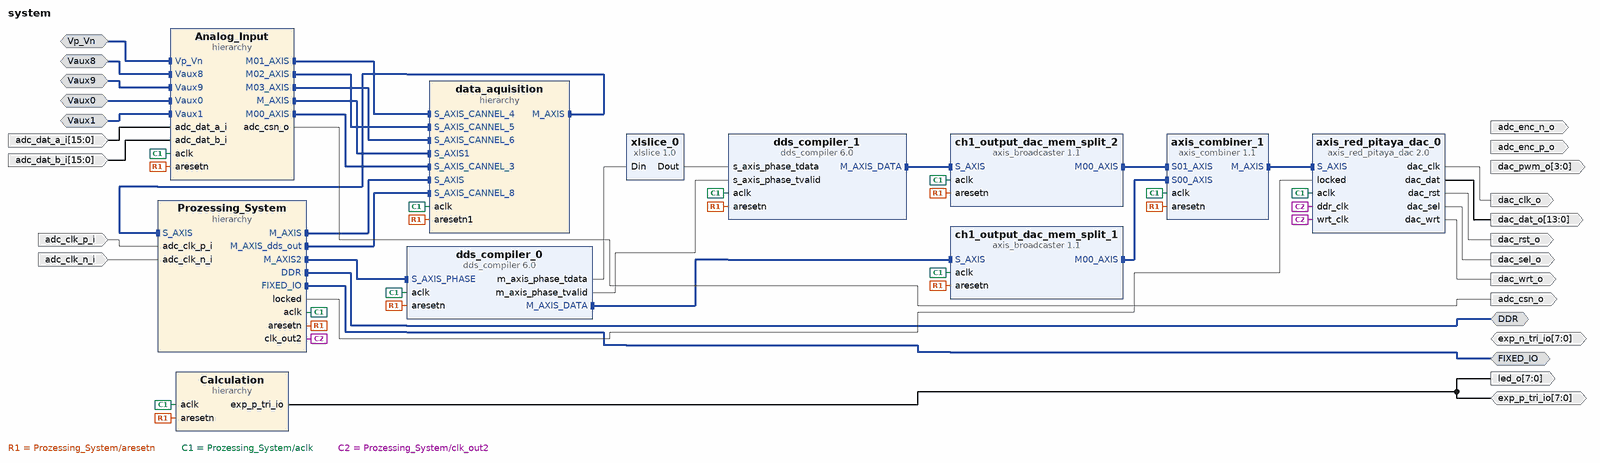
[diagram p0: block diagram of the top level]
# Vivado block design system, xc7z010clg400-1, Vivado 2020.2
create_bd_design system

create_bd_intf_port -mode Master -vlnv xilinx.com:interface:ddrx_rtl:1.0 DDR
create_bd_intf_port -mode Master -vlnv xilinx.com:display_processing_system7:fixedio_rtl:1.0 FIXED_IO
create_bd_intf_port -mode Slave -vlnv xilinx.com:interface:diff_analog_io_rtl:1.0 Vp_Vn
create_bd_intf_port -mode Slave -vlnv xilinx.com:interface:diff_analog_io_rtl:1.0 Vaux0
create_bd_intf_port -mode Slave -vlnv xilinx.com:interface:diff_analog_io_rtl:1.0 Vaux1
create_bd_intf_port -mode Slave -vlnv xilinx.com:interface:diff_analog_io_rtl:1.0 Vaux8
create_bd_intf_port -mode Slave -vlnv xilinx.com:interface:diff_analog_io_rtl:1.0 Vaux9
create_bd_port -dir I -from 15 -to 0 adc_dat_a_i
create_bd_port -dir I -from 15 -to 0 adc_dat_b_i
create_bd_port -dir I adc_clk_p_i
create_bd_port -dir I adc_clk_n_i
create_bd_port -dir O adc_enc_p_o
create_bd_port -dir O adc_enc_n_o
create_bd_port -dir O adc_csn_o
create_bd_port -dir O -from 13 -to 0 dac_dat_o
create_bd_port -dir O dac_clk_o
create_bd_port -dir O dac_rst_o
create_bd_port -dir O dac_sel_o
create_bd_port -dir O dac_wrt_o
create_bd_port -dir O -from 3 -to 0 dac_pwm_o
create_bd_port -dir IO -from 7 -to 0 exp_p_tri_io
create_bd_port -dir IO -from 7 -to 0 exp_n_tri_io
create_bd_port -dir O -from 7 -to 0 led_o

create_bd_cell -type hier Prozessing_System
create_bd_cell -type hier data_aquisition
create_bd_cell -type hier Calculation
create_bd_cell -type ip -vlnv xilinx.com:user:axis_red_pitaya_dac:2.0 axis_red_pitaya_dac_0
create_bd_cell -type hier Analog_Input
create_bd_cell -type ip -vlnv xilinx.com:ip:axis_combiner:1.1 axis_combiner_1
set_property -dict {CONFIG.TDATA_NUM_BYTES 2} [get_bd_cells axis_combiner_1]
create_bd_cell -type ip -vlnv xilinx.com:ip:dds_compiler:6.0 dds_compiler_0
set_property -dict [list \
  CONFIG.DATA_Has_TLAST Not_Required \
  CONFIG.DDS_Clock_Rate 125 \
  CONFIG.Frequency_Resolution 0.4 \
  CONFIG.Has_ARESETn true \
  CONFIG.Latency 7 \
  CONFIG.Noise_Shaping None \
  CONFIG.Output_Frequency1 0 \
  CONFIG.Output_Width 14 \
  CONFIG.PINC1 0 \
  CONFIG.Parameter_Entry Hardware_Parameters \
  CONFIG.Phase_Increment Streaming \
  CONFIG.Phase_Width 30 \
  CONFIG.Phase_offset None \
  CONFIG.S_PHASE_Has_TUSER Not_Required \
] [get_bd_cells dds_compiler_0]
create_bd_cell -type ip -vlnv xilinx.com:ip:dds_compiler:6.0 dds_compiler_1
set_property -dict [list \
  CONFIG.DATA_Has_TLAST Not_Required \
  CONFIG.DDS_Clock_Rate 100 \
  CONFIG.Has_ARESETn true \
  CONFIG.Has_Phase_Out false \
  CONFIG.Latency 6 \
  CONFIG.M_DATA_Has_TUSER Not_Required \
  CONFIG.Noise_Shaping None \
  CONFIG.Optimization_Goal Speed \
  CONFIG.Output_Frequency1 0 \
  CONFIG.Output_Width 14 \
  CONFIG.PINC1 0 \
  CONFIG.Parameter_Entry Hardware_Parameters \
  CONFIG.PartsPresent SIN_COS_LUT_only \
  CONFIG.Phase_Width 16 \
  CONFIG.S_PHASE_Has_TUSER Not_Required \
] [get_bd_cells dds_compiler_1]
create_bd_cell -type ip -vlnv xilinx.com:ip:axis_broadcaster:1.1 ch1_output_dac_mem_split_1
set_property -dict [list \
  CONFIG.M00_TDATA_REMAP {tdata[15:0]} \
  CONFIG.M01_TDATA_REMAP {tdata[31:16]} \
  CONFIG.M02_TDATA_REMAP {tdata[31:16]} \
  CONFIG.M03_TDATA_REMAP {tdata[31:16]} \
  CONFIG.M_TDATA_NUM_BYTES 2 \
  CONFIG.NUM_MI 2 \
  CONFIG.S_TDATA_NUM_BYTES 4 \
] [get_bd_cells ch1_output_dac_mem_split_1]
create_bd_cell -type ip -vlnv xilinx.com:ip:axis_broadcaster:1.1 ch1_output_dac_mem_split_2
set_property -dict [list \
  CONFIG.M00_TDATA_REMAP {tdata[15:0]} \
  CONFIG.M01_TDATA_REMAP {tdata[31:16]} \
  CONFIG.M02_TDATA_REMAP {tdata[31:16]} \
  CONFIG.M03_TDATA_REMAP {tdata[31:16]} \
  CONFIG.M_TDATA_NUM_BYTES 2 \
  CONFIG.NUM_MI 2 \
  CONFIG.S_TDATA_NUM_BYTES 4 \
] [get_bd_cells ch1_output_dac_mem_split_2]
create_bd_cell -type ip -vlnv xilinx.com:ip:xlslice:1.0 xlslice_0
set_property -dict {CONFIG.DIN_FROM 28 CONFIG.DIN_TO 13 CONFIG.DOUT_WIDTH 16} [get_bd_cells xlslice_0]

# ---- hierarchy /Prozessing_System ----
current_bd_instance /Prozessing_System
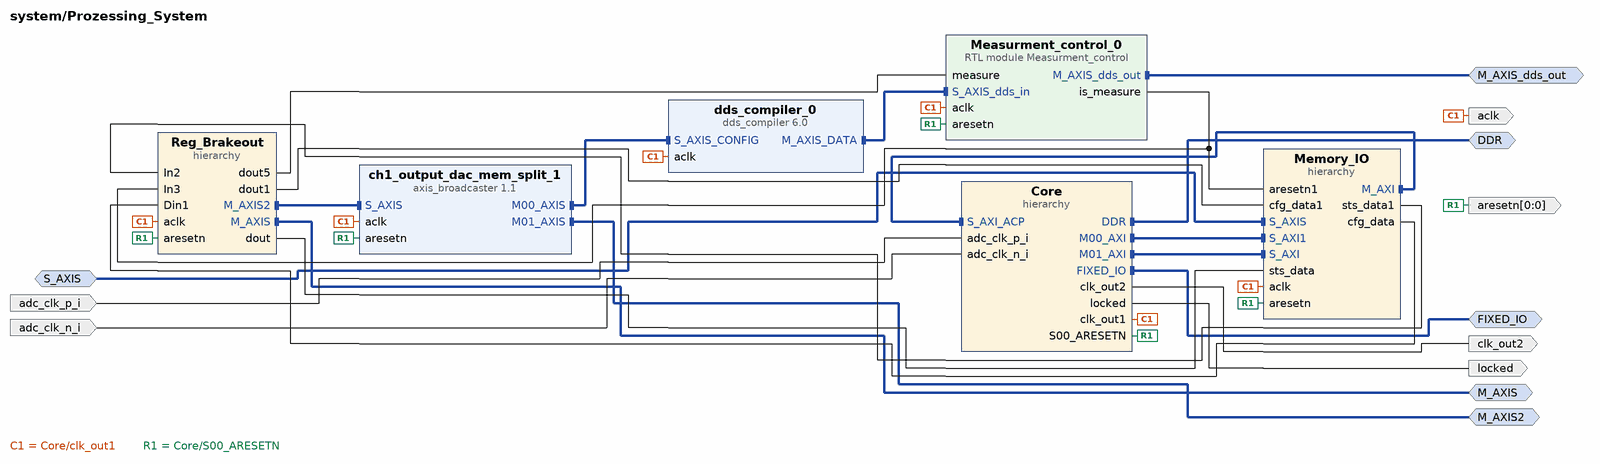
[diagram p1: block diagram inside /Prozessing_System]
create_bd_intf_pin -mode Master -vlnv xilinx.com:interface:ddrx_rtl:1.0 DDR
create_bd_intf_pin -mode Master -vlnv xilinx.com:display_processing_system7:fixedio_rtl:1.0 FIXED_IO
create_bd_intf_pin -mode Slave -vlnv xilinx.com:interface:axis_rtl:1.0 S_AXIS
create_bd_intf_pin -mode Master -vlnv xilinx.com:interface:axis_rtl:1.0 M_AXIS
create_bd_intf_pin -mode Master -vlnv xilinx.com:interface:axis_rtl:1.0 M_AXIS_dds_out
create_bd_intf_pin -mode Master -vlnv xilinx.com:interface:axis_rtl:1.0 M_AXIS2
create_bd_pin -dir O -type clk aclk
create_bd_pin -dir O locked
create_bd_pin -dir O -from 0 -to 0 -type rst aresetn
create_bd_pin -dir I adc_clk_p_i
create_bd_pin -dir I adc_clk_n_i
create_bd_pin -dir O -type clk clk_out2

create_bd_cell -type hier Core
create_bd_cell -type hier Memory_IO
create_bd_cell -type hier Reg_Brakeout
create_bd_cell -type ip -vlnv xilinx.com:ip:dds_compiler:6.0 dds_compiler_0
set_property -dict [list \
  CONFIG.DATA_Has_TLAST Not_Required \
  CONFIG.DDS_Clock_Rate 125 \
  CONFIG.Frequency_Resolution 0.4 \
  CONFIG.Has_Phase_Out false \
  CONFIG.Latency 7 \
  CONFIG.M_DATA_Has_TUSER Not_Required \
  CONFIG.Noise_Shaping None \
  CONFIG.Output_Frequency1 0 \
  CONFIG.Output_Width 16 \
  CONFIG.PINC1 101010 \
  CONFIG.Parameter_Entry Hardware_Parameters \
  CONFIG.Phase_Increment Programmable \
  CONFIG.Phase_Width 30 \
  CONFIG.Resync false \
  CONFIG.S_PHASE_Has_TUSER Not_Required \
] [get_bd_cells dds_compiler_0]
create_bd_cell -type module -reference Measurment_control Measurment_control_0
create_bd_cell -type ip -vlnv xilinx.com:ip:axis_broadcaster:1.1 ch1_output_dac_mem_split_1
set_property -dict [list \
  CONFIG.M00_TDATA_REMAP {tdata[31:0]} \
  CONFIG.M01_TDATA_REMAP {tdata[31:0]} \
  CONFIG.M02_TDATA_REMAP {tdata[31:16]} \
  CONFIG.M03_TDATA_REMAP {tdata[31:16]} \
  CONFIG.M_TDATA_NUM_BYTES 4 \
  CONFIG.NUM_MI 2 \
  CONFIG.S_TDATA_NUM_BYTES 4 \
] [get_bd_cells ch1_output_dac_mem_split_1]

# ---- hierarchy /Prozessing_System/Core ----
current_bd_instance /Prozessing_System/Core
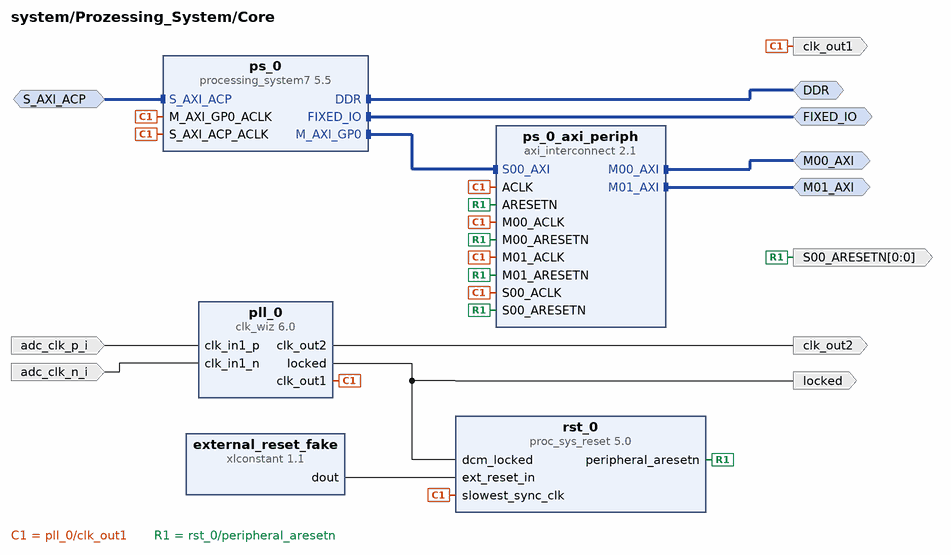
[diagram p2: block diagram inside /Prozessing_System/Core]
create_bd_intf_pin -mode Master -vlnv xilinx.com:interface:ddrx_rtl:1.0 DDR
create_bd_intf_pin -mode Master -vlnv xilinx.com:display_processing_system7:fixedio_rtl:1.0 FIXED_IO
create_bd_intf_pin -mode Slave -vlnv xilinx.com:interface:aximm_rtl:1.0 S_AXI_ACP
create_bd_intf_pin -mode Master -vlnv xilinx.com:interface:aximm_rtl:1.0 M00_AXI
create_bd_intf_pin -mode Master -vlnv xilinx.com:interface:aximm_rtl:1.0 M01_AXI
create_bd_pin -dir O -type clk clk_out1
create_bd_pin -dir O locked
create_bd_pin -dir O -from 0 -to 0 -type rst S00_ARESETN
create_bd_pin -dir I adc_clk_p_i
create_bd_pin -dir I adc_clk_n_i
create_bd_pin -dir O -type clk clk_out2

create_bd_cell -type ip -vlnv xilinx.com:ip:proc_sys_reset:5.0 rst_0
create_bd_cell -type ip -vlnv xilinx.com:ip:clk_wiz:6.0 pll_0
set_property -dict [list \
  CONFIG.CLKOUT1_REQUESTED_OUT_FREQ 125.0 \
  CONFIG.CLKOUT1_USED true \
  CONFIG.CLKOUT2_REQUESTED_OUT_FREQ 250.0 \
  CONFIG.CLKOUT2_REQUESTED_PHASE 157.5 \
  CONFIG.CLKOUT2_USED true \
  CONFIG.CLKOUT3_REQUESTED_OUT_FREQ 250.0 \
  CONFIG.CLKOUT3_REQUESTED_PHASE 202.5 \
  CONFIG.CLKOUT3_USED false \
  CONFIG.CLKOUT4_JITTER 119.348 \
  CONFIG.CLKOUT4_PHASE_ERROR 96.948 \
  CONFIG.CLKOUT4_REQUESTED_OUT_FREQ 125 \
  CONFIG.CLKOUT4_USED false \
  CONFIG.CLKOUT5_JITTER 119.348 \
  CONFIG.CLKOUT5_PHASE_ERROR 96.948 \
  CONFIG.CLKOUT5_REQUESTED_OUT_FREQ 125 \
  CONFIG.CLKOUT5_USED false \
  CONFIG.CLKOUT6_JITTER 119.348 \
  CONFIG.CLKOUT6_PHASE_ERROR 96.948 \
  CONFIG.CLKOUT6_REQUESTED_OUT_FREQ 125 \
  CONFIG.CLKOUT6_USED false \
  CONFIG.MMCM_CLKOUT2_DIVIDE 1 \
  CONFIG.MMCM_CLKOUT3_DIVIDE 1 \
  CONFIG.MMCM_CLKOUT4_DIVIDE 1 \
  CONFIG.MMCM_CLKOUT5_DIVIDE 1 \
  CONFIG.NUM_OUT_CLKS 2 \
  CONFIG.PRIMITIVE PLL \
  CONFIG.PRIM_IN_FREQ 125.0 \
  CONFIG.PRIM_SOURCE Differential_clock_capable_pin \
  CONFIG.USE_RESET false \
] [get_bd_cells pll_0]
create_bd_cell -type ip -vlnv xilinx.com:ip:processing_system7:5.5 ps_0
set_property -dict [list \
  CONFIG.PCW_APU_PERIPHERAL_FREQMHZ 666.666666 \
  CONFIG.PCW_ENET0_ENET0_IO {MIO 16 .. 27} \
  CONFIG.PCW_ENET0_GRP_MDIO_ENABLE 1 \
  CONFIG.PCW_ENET0_GRP_MDIO_IO {MIO 52 .. 53} \
  CONFIG.PCW_ENET0_PERIPHERAL_ENABLE 1 \
  CONFIG.PCW_ENET0_RESET_ENABLE 0 \
  CONFIG.PCW_ENET_RESET_ENABLE 1 \
  CONFIG.PCW_ENET_RESET_SELECT {Share reset pin} \
  CONFIG.PCW_FPGA0_PERIPHERAL_FREQMHZ 50 \
  CONFIG.PCW_FPGA1_PERIPHERAL_FREQMHZ 50 \
  CONFIG.PCW_GPIO_EMIO_GPIO_ENABLE 1 \
  CONFIG.PCW_GPIO_EMIO_GPIO_IO 64 \
  CONFIG.PCW_GPIO_MIO_GPIO_ENABLE 1 \
  CONFIG.PCW_GPIO_MIO_GPIO_IO MIO \
  CONFIG.PCW_GPIO_PERIPHERAL_ENABLE 1 \
  CONFIG.PCW_I2C0_GRP_INT_ENABLE 0 \
  CONFIG.PCW_I2C0_I2C0_IO {MIO 50 .. 51} \
  CONFIG.PCW_I2C0_PERIPHERAL_ENABLE 1 \
  CONFIG.PCW_I2C_PERIPHERAL_FREQMHZ 111.111115 \
  CONFIG.PCW_I2C_RESET_ENABLE 1 \
  CONFIG.PCW_I2C_RESET_SELECT {Share reset pin} \
  CONFIG.PCW_IMPORT_BOARD_PRESET cfg/red_pitaya.xml \
  CONFIG.PCW_PRESET_BANK1_VOLTAGE {LVCMOS 2.5V} \
  CONFIG.PCW_QSPI_PERIPHERAL_ENABLE 0 \
  CONFIG.PCW_SD0_GRP_CD_ENABLE 1 \
  CONFIG.PCW_SD0_GRP_CD_IO {MIO 46} \
  CONFIG.PCW_SD0_GRP_WP_ENABLE 1 \
  CONFIG.PCW_SD0_GRP_WP_IO {MIO 47} \
  CONFIG.PCW_SD0_PERIPHERAL_ENABLE 1 \
  CONFIG.PCW_SD0_SD0_IO {MIO 40 .. 45} \
  CONFIG.PCW_SDIO_PERIPHERAL_FREQMHZ 100 \
  CONFIG.PCW_SPI0_PERIPHERAL_ENABLE 1 \
  CONFIG.PCW_SPI0_SPI0_IO EMIO \
  CONFIG.PCW_SPI1_PERIPHERAL_ENABLE 1 \
  CONFIG.PCW_SPI1_SPI1_IO {MIO 10 .. 15} \
  CONFIG.PCW_UART0_PERIPHERAL_ENABLE 1 \
  CONFIG.PCW_UART0_UART0_IO {MIO 14 .. 15} \
  CONFIG.PCW_UART1_PERIPHERAL_ENABLE 1 \
  CONFIG.PCW_UART1_UART1_IO {MIO 8 .. 9} \
  CONFIG.PCW_UART_PERIPHERAL_FREQMHZ 100 \
  CONFIG.PCW_UIPARAM_DDR_BUS_WIDTH {16 Bit} \
  CONFIG.PCW_UIPARAM_DDR_FREQ_MHZ 533.333333 \
  CONFIG.PCW_UIPARAM_DDR_PARTNO {MT41J256M16 RE-125} \
  CONFIG.PCW_USB0_PERIPHERAL_ENABLE 1 \
  CONFIG.PCW_USB0_RESET_ENABLE 1 \
  CONFIG.PCW_USB0_RESET_IO {MIO 48} \
  CONFIG.PCW_USB0_USB0_IO {MIO 28 .. 39} \
  CONFIG.PCW_USB_RESET_ENABLE 1 \
  CONFIG.PCW_USB_RESET_SELECT {Share reset pin} \
  CONFIG.PCW_USE_DEFAULT_ACP_USER_VAL 1 \
  CONFIG.PCW_USE_S_AXI_ACP 1 \
] [get_bd_cells ps_0]
# 429 more settings of ps_0 are not shown: defaults, MIO pin electricals, DDR timing, and values the tool derives
create_bd_cell -type ip -vlnv xilinx.com:ip:axi_interconnect:2.1 ps_0_axi_periph
set_property -dict {CONFIG.NUM_MI 2} [get_bd_cells ps_0_axi_periph]
create_bd_cell -type ip -vlnv xilinx.com:ip:xlconstant:1.1 external_reset_fake

# ---- hierarchy /Prozessing_System/Memory_IO ----
current_bd_instance /Prozessing_System/Memory_IO
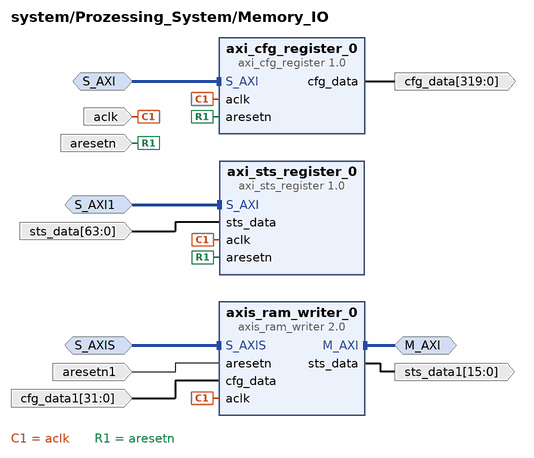
[diagram p3: block diagram inside /Prozessing_System/Memory_IO]
create_bd_intf_pin -mode Slave -vlnv xilinx.com:interface:aximm_rtl:1.0 S_AXI
create_bd_intf_pin -mode Slave -vlnv xilinx.com:interface:aximm_rtl:1.0 S_AXI1
create_bd_intf_pin -mode Slave -vlnv xilinx.com:interface:axis_rtl:1.0 S_AXIS
create_bd_intf_pin -mode Master -vlnv xilinx.com:interface:aximm_rtl:1.0 M_AXI
create_bd_pin -dir I -type clk aclk
create_bd_pin -dir I -type rst aresetn
create_bd_pin -dir I -type rst aresetn1
create_bd_pin -dir I -from 31 -to 0 cfg_data1
create_bd_pin -dir O -from 15 -to 0 sts_data1
create_bd_pin -dir O -from 319 -to 0 cfg_data
create_bd_pin -dir I -from 63 -to 0 sts_data

create_bd_cell -type ip -vlnv xilinx.com:user:axi_sts_register:1.0 axi_sts_register_0
set_property -dict {CONFIG.AXI_ADDR_WIDTH 32 CONFIG.STS_DATA_WIDTH 64} [get_bd_cells axi_sts_register_0]
create_bd_cell -type ip -vlnv xilinx.com:user:axi_cfg_register:1.0 axi_cfg_register_0
set_property -dict {CONFIG.AXI_ADDR_WIDTH 32 CONFIG.CFG_DATA_WIDTH 320} [get_bd_cells axi_cfg_register_0]
create_bd_cell -type ip -vlnv xilinx.com:user:axis_ram_writer:2.0 axis_ram_writer_0
set_property -dict {CONFIG.ADDR_WIDTH 16 CONFIG.AXIS_TDATA_WIDTH 128 CONFIG.AXI_ID_WIDTH 3} [get_bd_cells axis_ram_writer_0]

# ---- hierarchy /Prozessing_System/Reg_Brakeout ----
current_bd_instance /Prozessing_System/Reg_Brakeout
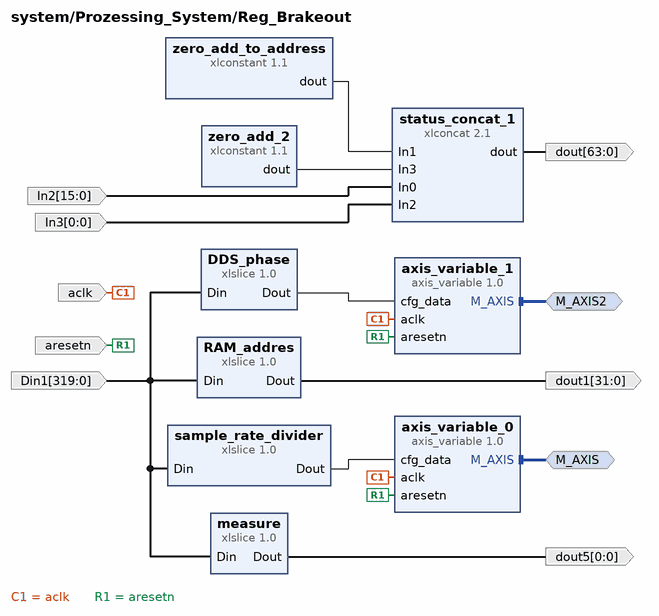
[diagram p4: block diagram inside /Prozessing_System/Reg_Brakeout]
create_bd_intf_pin -mode Master -vlnv xilinx.com:interface:axis_rtl:1.0 M_AXIS
create_bd_intf_pin -mode Master -vlnv xilinx.com:interface:axis_rtl:1.0 M_AXIS2
create_bd_pin -dir I -type clk aclk
create_bd_pin -dir I -type rst aresetn
create_bd_pin -dir O -from 31 -to 0 dout1
create_bd_pin -dir I -from 15 -to 0 In2
create_bd_pin -dir O -from 0 -to 0 dout5
create_bd_pin -dir I -from 319 -to 0 Din1
create_bd_pin -dir I -from 0 -to 0 In3
create_bd_pin -dir O -from 63 -to 0 dout

create_bd_cell -type ip -vlnv xilinx.com:ip:xlconcat:2.1 status_concat_1
set_property -dict [list \
  CONFIG.IN0_WIDTH 16 \
  CONFIG.IN1_WIDTH 16 \
  CONFIG.IN2_WIDTH 1 \
  CONFIG.IN3_WIDTH 31 \
  CONFIG.NUM_PORTS 4 \
] [get_bd_cells status_concat_1]
create_bd_cell -type ip -vlnv xilinx.com:ip:xlslice:1.0 sample_rate_divider
set_property -dict [list \
  CONFIG.DIN_FROM 31 \
  CONFIG.DIN_TO 16 \
  CONFIG.DIN_WIDTH 320 \
  CONFIG.DOUT_WIDTH 16 \
] [get_bd_cells sample_rate_divider]
create_bd_cell -type ip -vlnv xilinx.com:ip:xlslice:1.0 RAM_addres
set_property -dict {CONFIG.DIN_FROM 63 CONFIG.DIN_TO 32 CONFIG.DIN_WIDTH 320 CONFIG.DOUT_WIDTH 32} [get_bd_cells RAM_addres]
create_bd_cell -type ip -vlnv xilinx.com:ip:xlslice:1.0 measure
set_property -dict {CONFIG.DIN_FROM 0 CONFIG.DIN_TO 0 CONFIG.DIN_WIDTH 320 CONFIG.DOUT_WIDTH 1} [get_bd_cells measure]
create_bd_cell -type ip -vlnv xilinx.com:user:axis_variable:1.0 axis_variable_0
set_property -dict {CONFIG.AXIS_TDATA_WIDTH 16} [get_bd_cells axis_variable_0]
create_bd_cell -type ip -vlnv xilinx.com:ip:xlconstant:1.1 zero_add_to_address
set_property -dict {CONFIG.CONST_VAL 0 CONFIG.CONST_WIDTH 16} [get_bd_cells zero_add_to_address]
create_bd_cell -type ip -vlnv xilinx.com:user:axis_variable:1.0 axis_variable_1
set_property -dict {CONFIG.AXIS_TDATA_WIDTH 32} [get_bd_cells axis_variable_1]
create_bd_cell -type ip -vlnv xilinx.com:ip:xlslice:1.0 DDS_phase
set_property -dict {CONFIG.DIN_FROM 95 CONFIG.DIN_TO 64 CONFIG.DIN_WIDTH 320 CONFIG.DOUT_WIDTH 32} [get_bd_cells DDS_phase]
create_bd_cell -type ip -vlnv xilinx.com:ip:xlconstant:1.1 zero_add_2
set_property -dict {CONFIG.CONST_VAL 0 CONFIG.CONST_WIDTH 31} [get_bd_cells zero_add_2]

# ---- hierarchy /data_aquisition ----
current_bd_instance /data_aquisition
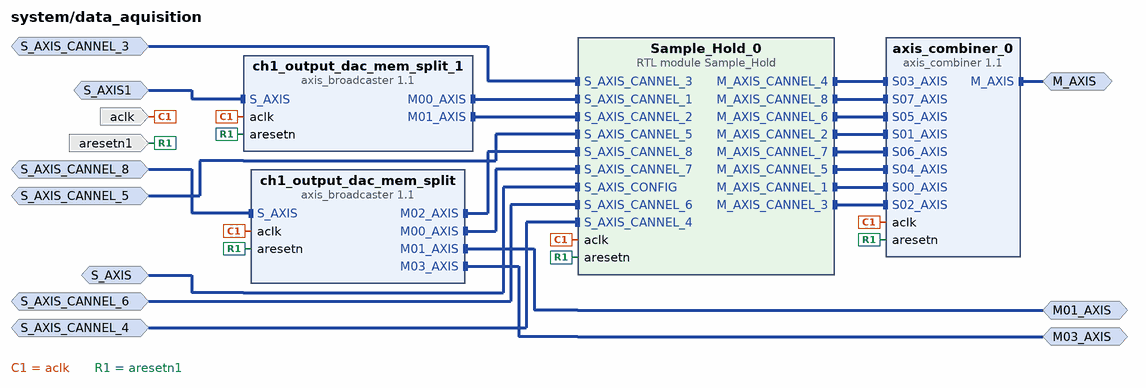
[diagram p5: block diagram inside /data_aquisition]
create_bd_intf_pin -mode Master -vlnv xilinx.com:interface:axis_rtl:1.0 M_AXIS
create_bd_intf_pin -mode Slave -vlnv xilinx.com:interface:axis_rtl:1.0 S_AXIS
create_bd_intf_pin -mode Slave -vlnv xilinx.com:interface:axis_rtl:1.0 S_AXIS_CANNEL_8
create_bd_intf_pin -mode Master -vlnv xilinx.com:interface:axis_rtl:1.0 M01_AXIS
create_bd_intf_pin -mode Master -vlnv xilinx.com:interface:axis_rtl:1.0 M03_AXIS
create_bd_intf_pin -mode Slave -vlnv xilinx.com:interface:axis_rtl:1.0 S_AXIS1
create_bd_intf_pin -mode Slave -vlnv xilinx.com:interface:axis_rtl:1.0 S_AXIS_CANNEL_3
create_bd_intf_pin -mode Slave -vlnv xilinx.com:interface:axis_rtl:1.0 S_AXIS_CANNEL_4
create_bd_intf_pin -mode Slave -vlnv xilinx.com:interface:axis_rtl:1.0 S_AXIS_CANNEL_5
create_bd_intf_pin -mode Slave -vlnv xilinx.com:interface:axis_rtl:1.0 S_AXIS_CANNEL_6
create_bd_pin -dir I -type clk aclk
create_bd_pin -dir I -type rst aresetn1

create_bd_cell -type ip -vlnv xilinx.com:ip:axis_combiner:1.1 axis_combiner_0
set_property -dict {CONFIG.NUM_SI 8 CONFIG.TDATA_NUM_BYTES 2} [get_bd_cells axis_combiner_0]
create_bd_cell -type module -reference Sample_Hold Sample_Hold_0
create_bd_cell -type ip -vlnv xilinx.com:ip:axis_broadcaster:1.1 ch1_output_dac_mem_split
set_property -dict [list \
  CONFIG.M00_TDATA_REMAP {tdata[15:0]} \
  CONFIG.M01_TDATA_REMAP {tdata[15:0]} \
  CONFIG.M02_TDATA_REMAP {tdata[31:16]} \
  CONFIG.M03_TDATA_REMAP {tdata[31:16]} \
  CONFIG.M_TDATA_NUM_BYTES 2 \
  CONFIG.NUM_MI 4 \
  CONFIG.S_TDATA_NUM_BYTES 4 \
] [get_bd_cells ch1_output_dac_mem_split]
create_bd_cell -type ip -vlnv xilinx.com:ip:axis_broadcaster:1.1 ch1_output_dac_mem_split_1
set_property -dict [list \
  CONFIG.M00_TDATA_REMAP {tdata[15:0]} \
  CONFIG.M01_TDATA_REMAP {tdata[31:16]} \
  CONFIG.M02_TDATA_REMAP {tdata[31:16]} \
  CONFIG.M03_TDATA_REMAP {tdata[31:16]} \
  CONFIG.M_TDATA_NUM_BYTES 2 \
  CONFIG.NUM_MI 2 \
  CONFIG.S_TDATA_NUM_BYTES 4 \
] [get_bd_cells ch1_output_dac_mem_split_1]

# ---- hierarchy /Calculation ----
current_bd_instance /Calculation
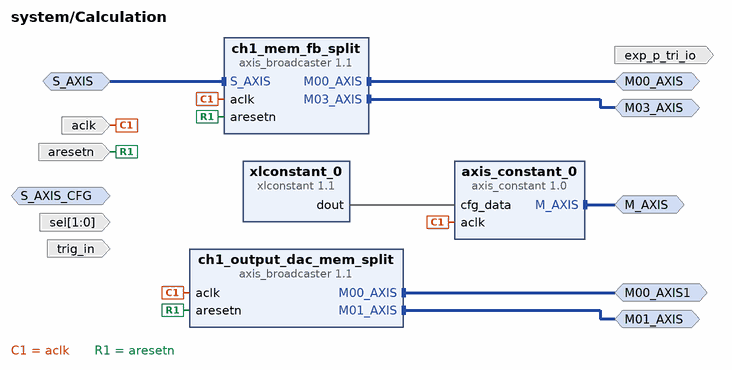
[diagram p6: block diagram inside /Calculation]
create_bd_intf_pin -mode Slave -vlnv xilinx.com:interface:axis_rtl:1.0 S_AXIS_CFG
create_bd_intf_pin -mode Slave -vlnv xilinx.com:interface:axis_rtl:1.0 S_AXIS
create_bd_intf_pin -mode Master -vlnv xilinx.com:interface:axis_rtl:1.0 M00_AXIS
create_bd_intf_pin -mode Master -vlnv xilinx.com:interface:axis_rtl:1.0 M00_AXIS1
create_bd_intf_pin -mode Master -vlnv xilinx.com:interface:axis_rtl:1.0 M03_AXIS
create_bd_intf_pin -mode Master -vlnv xilinx.com:interface:axis_rtl:1.0 M01_AXIS
create_bd_intf_pin -mode Master -vlnv xilinx.com:interface:axis_rtl:1.0 M_AXIS
create_bd_pin -dir I -type clk aclk
create_bd_pin -dir I trig_in
create_bd_pin -dir I -from 1 -to 0 sel
create_bd_pin -dir O exp_p_tri_io
create_bd_pin -dir I -type rst aresetn

create_bd_cell -type ip -vlnv xilinx.com:ip:xlconstant:1.1 xlconstant_0
set_property -dict {CONFIG.CONST_VAL 500 CONFIG.CONST_WIDTH 16} [get_bd_cells xlconstant_0]
create_bd_cell -type ip -vlnv xilinx.com:user:axis_constant:1.0 axis_constant_0
set_property -dict {CONFIG.AXIS_TDATA_WIDTH 16} [get_bd_cells axis_constant_0]
create_bd_cell -type ip -vlnv xilinx.com:ip:axis_broadcaster:1.1 ch1_mem_fb_split
set_property -dict [list \
  CONFIG.M00_TDATA_REMAP {tdata[15:0]} \
  CONFIG.M01_TDATA_REMAP {tdata[15:0]} \
  CONFIG.M02_TDATA_REMAP {tdata[31:16]} \
  CONFIG.M03_TDATA_REMAP {tdata[31:16]} \
  CONFIG.M_TDATA_NUM_BYTES 2 \
  CONFIG.NUM_MI 4 \
  CONFIG.S_TDATA_NUM_BYTES 4 \
] [get_bd_cells ch1_mem_fb_split]
create_bd_cell -type ip -vlnv xilinx.com:ip:axis_broadcaster:1.1 ch1_output_dac_mem_split
set_property -dict [list \
  CONFIG.M00_TDATA_REMAP {tdata[15:0]} \
  CONFIG.M01_TDATA_REMAP {tdata[15:0]} \
  CONFIG.M_TDATA_NUM_BYTES 2 \
  CONFIG.S_TDATA_NUM_BYTES 2 \
] [get_bd_cells ch1_output_dac_mem_split]

# ---- hierarchy /Analog_Input ----
current_bd_instance /Analog_Input
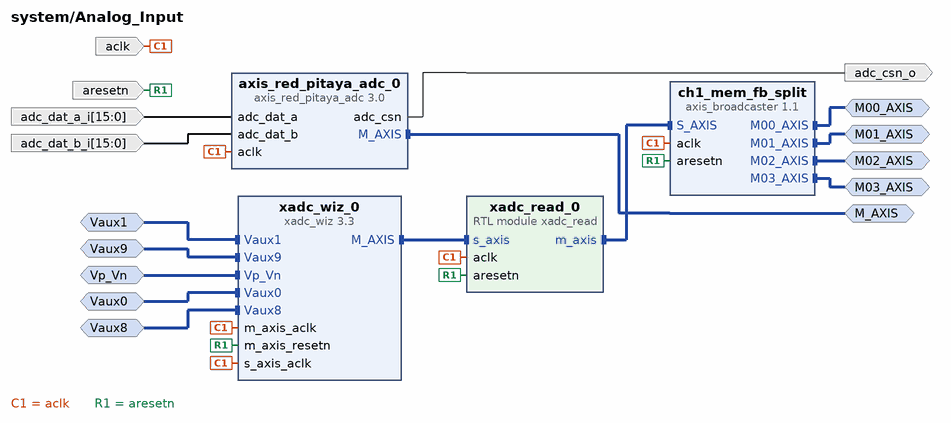
[diagram p7: block diagram inside /Analog_Input]
create_bd_intf_pin -mode Slave -vlnv xilinx.com:interface:diff_analog_io_rtl:1.0 Vp_Vn
create_bd_intf_pin -mode Slave -vlnv xilinx.com:interface:diff_analog_io_rtl:1.0 Vaux0
create_bd_intf_pin -mode Slave -vlnv xilinx.com:interface:diff_analog_io_rtl:1.0 Vaux1
create_bd_intf_pin -mode Slave -vlnv xilinx.com:interface:diff_analog_io_rtl:1.0 Vaux8
create_bd_intf_pin -mode Slave -vlnv xilinx.com:interface:diff_analog_io_rtl:1.0 Vaux9
create_bd_intf_pin -mode Master -vlnv xilinx.com:interface:axis_rtl:1.0 M_AXIS
create_bd_intf_pin -mode Master -vlnv xilinx.com:interface:axis_rtl:1.0 M00_AXIS
create_bd_intf_pin -mode Master -vlnv xilinx.com:interface:axis_rtl:1.0 M01_AXIS
create_bd_intf_pin -mode Master -vlnv xilinx.com:interface:axis_rtl:1.0 M02_AXIS
create_bd_intf_pin -mode Master -vlnv xilinx.com:interface:axis_rtl:1.0 M03_AXIS
create_bd_pin -dir I -type clk aclk
create_bd_pin -dir I -type rst aresetn
create_bd_pin -dir O adc_csn_o
create_bd_pin -dir I -from 15 -to 0 adc_dat_a_i
create_bd_pin -dir I -from 15 -to 0 adc_dat_b_i

create_bd_cell -type ip -vlnv xilinx.com:ip:xadc_wiz:3.3 xadc_wiz_0
set_property -dict [list \
  CONFIG.ADC_CONVERSION_RATE 1000 \
  CONFIG.ADC_OFFSET_AND_GAIN_CALIBRATION false \
  CONFIG.CHANNEL_ENABLE_TEMPERATURE false \
  CONFIG.CHANNEL_ENABLE_VAUXP0_VAUXN0 true \
  CONFIG.CHANNEL_ENABLE_VAUXP1_VAUXN1 true \
  CONFIG.CHANNEL_ENABLE_VAUXP8_VAUXN8 true \
  CONFIG.CHANNEL_ENABLE_VAUXP9_VAUXN9 true \
  CONFIG.CHANNEL_ENABLE_VP_VN false \
  CONFIG.DCLK_FREQUENCY 125 \
  CONFIG.ENABLE_AXI4STREAM true \
  CONFIG.ENABLE_CALIBRATION_AVERAGING false \
  CONFIG.ENABLE_RESET false \
  CONFIG.ENABLE_VCCDDRO_ALARM false \
  CONFIG.ENABLE_VCCPAUX_ALARM false \
  CONFIG.ENABLE_VCCPINT_ALARM false \
  CONFIG.EXTERNAL_MUX_CHANNEL VP_VN \
  CONFIG.INTERFACE_SELECTION None \
  CONFIG.OT_ALARM false \
  CONFIG.SENSOR_OFFSET_AND_GAIN_CALIBRATION false \
  CONFIG.SEQUENCER_MODE Continuous \
  CONFIG.SINGLE_CHANNEL_SELECTION TEMPERATURE \
  CONFIG.USER_TEMP_ALARM false \
  CONFIG.VCCAUX_ALARM false \
  CONFIG.VCCINT_ALARM false \
  CONFIG.XADC_STARUP_SELECTION channel_sequencer \
] [get_bd_cells xadc_wiz_0]
create_bd_cell -type ip -vlnv xilinx.com:user:axis_red_pitaya_adc:3.0 axis_red_pitaya_adc_0
create_bd_cell -type module -reference xadc_read xadc_read_0
create_bd_cell -type ip -vlnv xilinx.com:ip:axis_broadcaster:1.1 ch1_mem_fb_split
set_property -dict [list \
  CONFIG.M00_TDATA_REMAP {tdata[15:0]} \
  CONFIG.M01_TDATA_REMAP {tdata[31:16]} \
  CONFIG.M02_TDATA_REMAP {tdata[47:32]} \
  CONFIG.M03_TDATA_REMAP {tdata[63:48]} \
  CONFIG.M_TDATA_NUM_BYTES 2 \
  CONFIG.NUM_MI 4 \
  CONFIG.S_TDATA_NUM_BYTES 8 \
] [get_bd_cells ch1_mem_fb_split]

# ---- connections ----

current_bd_instance /Prozessing_System
connect_bd_intf_net -intf_net rate_0_M_AXIS [get_bd_intf_pins M_AXIS] [get_bd_intf_pins Reg_Brakeout/M_AXIS]
connect_bd_intf_net -intf_net conv_0_M_AXIS [get_bd_intf_pins S_AXIS] [get_bd_intf_pins Memory_IO/S_AXIS]
connect_bd_intf_net -intf_net ps_0_FIXED_IO [get_bd_intf_pins FIXED_IO] [get_bd_intf_pins Core/FIXED_IO]
connect_bd_intf_net [get_bd_intf_pins dds_compiler_0/M_AXIS_DATA] [get_bd_intf_pins Measurment_control_0/S_AXIS_dds_in]
connect_bd_intf_net [get_bd_intf_pins Core/M00_AXI] [get_bd_intf_pins Memory_IO/S_AXI1]
connect_bd_intf_net [get_bd_intf_pins Core/M01_AXI] [get_bd_intf_pins Memory_IO/S_AXI]
connect_bd_intf_net [get_bd_intf_pins M_AXIS2] [get_bd_intf_pins ch1_output_dac_mem_split_1/M01_AXIS]
connect_bd_intf_net -intf_net writer_0_M_AXI [get_bd_intf_pins Memory_IO/M_AXI] [get_bd_intf_pins Core/S_AXI_ACP]
connect_bd_intf_net [get_bd_intf_pins Reg_Brakeout/M_AXIS2] [get_bd_intf_pins ch1_output_dac_mem_split_1/S_AXIS]
connect_bd_intf_net [get_bd_intf_pins M_AXIS_dds_out] [get_bd_intf_pins Measurment_control_0/M_AXIS_dds_out]
connect_bd_intf_net -intf_net ps_0_DDR [get_bd_intf_pins DDR] [get_bd_intf_pins Core/DDR]
connect_bd_intf_net [get_bd_intf_pins ch1_output_dac_mem_split_1/M00_AXIS] [get_bd_intf_pins dds_compiler_0/S_AXIS_CONFIG]
connect_bd_net -net slice_3_dout [get_bd_pins Reg_Brakeout/dout1] [get_bd_pins Memory_IO/cfg_data1]
connect_bd_net -net writer_0_sts_data [get_bd_pins Memory_IO/sts_data1] [get_bd_pins Reg_Brakeout/In2]
connect_bd_net [get_bd_pins Memory_IO/cfg_data] [get_bd_pins Reg_Brakeout/Din1]
connect_bd_net -net pll_0_clk_out1 [get_bd_pins Core/clk_out1] \
  [get_bd_pins aclk] [get_bd_pins Memory_IO/aclk] [get_bd_pins Reg_Brakeout/aclk] [get_bd_pins dds_compiler_0/aclk] \
  [get_bd_pins Measurment_control_0/aclk] [get_bd_pins ch1_output_dac_mem_split_1/aclk]
connect_bd_net -net pll_0_locked [get_bd_pins Core/locked] [get_bd_pins locked]
connect_bd_net -net rst_0_peripheral_aresetn [get_bd_pins Core/S00_ARESETN] \
  [get_bd_pins aresetn] [get_bd_pins Memory_IO/aresetn] [get_bd_pins Reg_Brakeout/aresetn] \
  [get_bd_pins Measurment_control_0/aresetn] [get_bd_pins ch1_output_dac_mem_split_1/aresetn]
connect_bd_net [get_bd_pins adc_clk_p_i] [get_bd_pins Core/adc_clk_p_i]
connect_bd_net [get_bd_pins adc_clk_n_i] [get_bd_pins Core/adc_clk_n_i]
connect_bd_net -net pll_0_clk_out2 [get_bd_pins Core/clk_out2] [get_bd_pins clk_out2]
connect_bd_net [get_bd_pins Reg_Brakeout/dout] [get_bd_pins Memory_IO/sts_data]
connect_bd_net [get_bd_pins Reg_Brakeout/dout5] [get_bd_pins Measurment_control_0/measure]
connect_bd_net -net In3_1 [get_bd_pins Measurment_control_0/is_measure] [get_bd_pins Reg_Brakeout/In3] [get_bd_pins Memory_IO/aresetn1]

current_bd_instance /Prozessing_System/Core
connect_bd_intf_net [get_bd_intf_pins FIXED_IO] [get_bd_intf_pins ps_0/FIXED_IO]
connect_bd_intf_net [get_bd_intf_pins ps_0/M_AXI_GP0] [get_bd_intf_pins ps_0_axi_periph/S00_AXI]
connect_bd_intf_net [get_bd_intf_pins M01_AXI] [get_bd_intf_pins ps_0_axi_periph/M01_AXI]
connect_bd_intf_net [get_bd_intf_pins M00_AXI] [get_bd_intf_pins ps_0_axi_periph/M00_AXI]
connect_bd_intf_net [get_bd_intf_pins DDR] [get_bd_intf_pins ps_0/DDR]
connect_bd_intf_net -intf_net writer_0_M_AXI [get_bd_intf_pins S_AXI_ACP] [get_bd_intf_pins ps_0/S_AXI_ACP]
connect_bd_net [get_bd_pins pll_0/clk_out1] \
  [get_bd_pins clk_out1] [get_bd_pins ps_0_axi_periph/M01_ACLK] [get_bd_pins ps_0_axi_periph/M00_ACLK] \
  [get_bd_pins ps_0_axi_periph/S00_ACLK] [get_bd_pins ps_0_axi_periph/ACLK] [get_bd_pins ps_0/S_AXI_ACP_ACLK] \
  [get_bd_pins ps_0/M_AXI_GP0_ACLK] [get_bd_pins rst_0/slowest_sync_clk]
connect_bd_net [get_bd_pins pll_0/locked] [get_bd_pins locked] [get_bd_pins rst_0/dcm_locked]
connect_bd_net [get_bd_pins rst_0/peripheral_aresetn] \
  [get_bd_pins S00_ARESETN] [get_bd_pins ps_0_axi_periph/S00_ARESETN] [get_bd_pins ps_0_axi_periph/M00_ARESETN] \
  [get_bd_pins ps_0_axi_periph/ARESETN] [get_bd_pins ps_0_axi_periph/M01_ARESETN]
connect_bd_net [get_bd_pins adc_clk_p_i] [get_bd_pins pll_0/clk_in1_p]
connect_bd_net [get_bd_pins adc_clk_n_i] [get_bd_pins pll_0/clk_in1_n]
connect_bd_net [get_bd_pins pll_0/clk_out2] [get_bd_pins clk_out2]
connect_bd_net -net xlconstant_0_dout [get_bd_pins external_reset_fake/dout] [get_bd_pins rst_0/ext_reset_in]

current_bd_instance /Prozessing_System/Memory_IO
connect_bd_intf_net [get_bd_intf_pins S_AXI] [get_bd_intf_pins axi_cfg_register_0/S_AXI]
connect_bd_intf_net [get_bd_intf_pins M_AXI] [get_bd_intf_pins axis_ram_writer_0/M_AXI]
connect_bd_intf_net -intf_net S_AXI1_1 [get_bd_intf_pins S_AXI1] [get_bd_intf_pins axi_sts_register_0/S_AXI]
connect_bd_intf_net [get_bd_intf_pins S_AXIS] [get_bd_intf_pins axis_ram_writer_0/S_AXIS]
connect_bd_net -net pll_0_clk_out1 [get_bd_pins aclk] \
  [get_bd_pins axi_sts_register_0/aclk] [get_bd_pins axi_cfg_register_0/aclk] [get_bd_pins axis_ram_writer_0/aclk]
connect_bd_net -net rst_0_peripheral_aresetn [get_bd_pins aresetn] [get_bd_pins axi_sts_register_0/aresetn] [get_bd_pins axi_cfg_register_0/aresetn]
connect_bd_net [get_bd_pins axi_cfg_register_0/cfg_data] [get_bd_pins cfg_data]
connect_bd_net [get_bd_pins axis_ram_writer_0/sts_data] [get_bd_pins sts_data1]
connect_bd_net -net aresetn1_1 [get_bd_pins aresetn1] [get_bd_pins axis_ram_writer_0/aresetn]
connect_bd_net -net cfg_data1_1 [get_bd_pins cfg_data1] [get_bd_pins axis_ram_writer_0/cfg_data]
connect_bd_net [get_bd_pins sts_data] [get_bd_pins axi_sts_register_0/sts_data]

current_bd_instance /Prozessing_System/Reg_Brakeout
connect_bd_intf_net [get_bd_intf_pins M_AXIS2] [get_bd_intf_pins axis_variable_1/M_AXIS]
connect_bd_intf_net [get_bd_intf_pins M_AXIS] [get_bd_intf_pins axis_variable_0/M_AXIS]
connect_bd_net -net pll_0_clk_out1 [get_bd_pins aclk] [get_bd_pins axis_variable_0/aclk] [get_bd_pins axis_variable_1/aclk]
connect_bd_net -net rst_0_peripheral_aresetn [get_bd_pins aresetn] [get_bd_pins axis_variable_0/aresetn] [get_bd_pins axis_variable_1/aresetn]
connect_bd_net [get_bd_pins sample_rate_divider/Dout] [get_bd_pins axis_variable_0/cfg_data]
connect_bd_net [get_bd_pins RAM_addres/Dout] [get_bd_pins dout1]
connect_bd_net -net ram_writer_reset_Dout [get_bd_pins measure/Dout] [get_bd_pins dout5]
connect_bd_net -net Din1_1 [get_bd_pins Din1] \
  [get_bd_pins RAM_addres/Din] [get_bd_pins sample_rate_divider/Din] [get_bd_pins measure/Din] [get_bd_pins DDS_phase/Din]
connect_bd_net -net In2_1 [get_bd_pins In2] [get_bd_pins status_concat_1/In0]
connect_bd_net -net external_reset_fake_1_dout [get_bd_pins zero_add_to_address/dout] [get_bd_pins status_concat_1/In1]
connect_bd_net -net In3_1 [get_bd_pins In3] [get_bd_pins status_concat_1/In2]
connect_bd_net -net sample_rate_divider1_Dout [get_bd_pins DDS_phase/Dout] [get_bd_pins axis_variable_1/cfg_data]
connect_bd_net [get_bd_pins zero_add_2/dout] [get_bd_pins status_concat_1/In3]
connect_bd_net [get_bd_pins status_concat_1/dout] [get_bd_pins dout]

current_bd_instance /data_aquisition
connect_bd_intf_net [get_bd_intf_pins S_AXIS_CANNEL_3] [get_bd_intf_pins Sample_Hold_0/S_AXIS_CANNEL_3]
connect_bd_intf_net -intf_net S_AXIS_CANNEL_8_1 [get_bd_intf_pins S_AXIS_CANNEL_8] [get_bd_intf_pins ch1_output_dac_mem_split/S_AXIS]
connect_bd_intf_net [get_bd_intf_pins axis_combiner_0/S03_AXIS] [get_bd_intf_pins Sample_Hold_0/M_AXIS_CANNEL_4]
connect_bd_intf_net [get_bd_intf_pins Sample_Hold_0/M_AXIS_CANNEL_8] [get_bd_intf_pins axis_combiner_0/S07_AXIS]
connect_bd_intf_net [get_bd_intf_pins S_AXIS1] [get_bd_intf_pins ch1_output_dac_mem_split_1/S_AXIS]
connect_bd_intf_net [get_bd_intf_pins S_AXIS_CANNEL_5] [get_bd_intf_pins Sample_Hold_0/S_AXIS_CANNEL_5]
connect_bd_intf_net [get_bd_intf_pins ch1_output_dac_mem_split/M02_AXIS] [get_bd_intf_pins Sample_Hold_0/S_AXIS_CANNEL_8]
connect_bd_intf_net [get_bd_intf_pins ch1_output_dac_mem_split_1/M00_AXIS] [get_bd_intf_pins Sample_Hold_0/S_AXIS_CANNEL_1]
connect_bd_intf_net [get_bd_intf_pins Sample_Hold_0/M_AXIS_CANNEL_6] [get_bd_intf_pins axis_combiner_0/S05_AXIS]
connect_bd_intf_net [get_bd_intf_pins axis_combiner_0/S01_AXIS] [get_bd_intf_pins Sample_Hold_0/M_AXIS_CANNEL_2]
connect_bd_intf_net [get_bd_intf_pins Sample_Hold_0/M_AXIS_CANNEL_7] [get_bd_intf_pins axis_combiner_0/S06_AXIS]
connect_bd_intf_net [get_bd_intf_pins S_AXIS] [get_bd_intf_pins Sample_Hold_0/S_AXIS_CONFIG]
connect_bd_intf_net [get_bd_intf_pins Sample_Hold_0/M_AXIS_CANNEL_5] [get_bd_intf_pins axis_combiner_0/S04_AXIS]
connect_bd_intf_net [get_bd_intf_pins axis_combiner_0/S00_AXIS] [get_bd_intf_pins Sample_Hold_0/M_AXIS_CANNEL_1]
connect_bd_intf_net -intf_net S_AXIS_CANNEL_6_1 [get_bd_intf_pins S_AXIS_CANNEL_6] [get_bd_intf_pins Sample_Hold_0/S_AXIS_CANNEL_6]
connect_bd_intf_net [get_bd_intf_pins M_AXIS] [get_bd_intf_pins axis_combiner_0/M_AXIS]
connect_bd_intf_net [get_bd_intf_pins Sample_Hold_0/S_AXIS_CANNEL_7] [get_bd_intf_pins ch1_output_dac_mem_split/M00_AXIS]
connect_bd_intf_net [get_bd_intf_pins S_AXIS_CANNEL_4] [get_bd_intf_pins Sample_Hold_0/S_AXIS_CANNEL_4]
connect_bd_intf_net [get_bd_intf_pins Sample_Hold_0/S_AXIS_CANNEL_2] [get_bd_intf_pins ch1_output_dac_mem_split_1/M01_AXIS]
connect_bd_intf_net [get_bd_intf_pins axis_combiner_0/S02_AXIS] [get_bd_intf_pins Sample_Hold_0/M_AXIS_CANNEL_3]
connect_bd_intf_net [get_bd_intf_pins M01_AXIS] [get_bd_intf_pins ch1_output_dac_mem_split/M01_AXIS]
connect_bd_intf_net [get_bd_intf_pins M03_AXIS] [get_bd_intf_pins ch1_output_dac_mem_split/M03_AXIS]
connect_bd_net -net pll_0_clk_out1 [get_bd_pins aclk] \
  [get_bd_pins axis_combiner_0/aclk] [get_bd_pins Sample_Hold_0/aclk] [get_bd_pins ch1_output_dac_mem_split/aclk] \
  [get_bd_pins ch1_output_dac_mem_split_1/aclk]
connect_bd_net -net rst_0_peripheral_aresetn [get_bd_pins aresetn1] \
  [get_bd_pins axis_combiner_0/aresetn] [get_bd_pins Sample_Hold_0/aresetn] [get_bd_pins ch1_output_dac_mem_split/aresetn] \
  [get_bd_pins ch1_output_dac_mem_split_1/aresetn]

current_bd_instance /Calculation
connect_bd_intf_net [get_bd_intf_pins M_AXIS] [get_bd_intf_pins axis_constant_0/M_AXIS]
connect_bd_intf_net [get_bd_intf_pins M00_AXIS1] [get_bd_intf_pins ch1_output_dac_mem_split/M00_AXIS]
connect_bd_intf_net [get_bd_intf_pins M00_AXIS] [get_bd_intf_pins ch1_mem_fb_split/M00_AXIS]
connect_bd_intf_net [get_bd_intf_pins M03_AXIS] [get_bd_intf_pins ch1_mem_fb_split/M03_AXIS]
connect_bd_intf_net [get_bd_intf_pins M01_AXIS] [get_bd_intf_pins ch1_output_dac_mem_split/M01_AXIS]
connect_bd_intf_net -intf_net axis_red_pitaya_adc_0_M_AXIS [get_bd_intf_pins S_AXIS] [get_bd_intf_pins ch1_mem_fb_split/S_AXIS]
connect_bd_net [get_bd_pins xlconstant_0/dout] [get_bd_pins axis_constant_0/cfg_data]
connect_bd_net -net pll_0_clk_out1 [get_bd_pins aclk] \
  [get_bd_pins ch1_mem_fb_split/aclk] [get_bd_pins ch1_output_dac_mem_split/aclk] [get_bd_pins axis_constant_0/aclk]
connect_bd_net -net rst_0_peripheral_aresetn [get_bd_pins aresetn] \
  [get_bd_pins ch1_output_dac_mem_split/aresetn] [get_bd_pins ch1_mem_fb_split/aresetn]

current_bd_instance /Analog_Input
connect_bd_intf_net [get_bd_intf_pins xadc_wiz_0/M_AXIS] [get_bd_intf_pins xadc_read_0/s_axis]
connect_bd_intf_net [get_bd_intf_pins M_AXIS] [get_bd_intf_pins axis_red_pitaya_adc_0/M_AXIS]
connect_bd_intf_net -intf_net Vaux1_1 [get_bd_intf_pins Vaux1] [get_bd_intf_pins xadc_wiz_0/Vaux1]
connect_bd_intf_net [get_bd_intf_pins M03_AXIS] [get_bd_intf_pins ch1_mem_fb_split/M03_AXIS]
connect_bd_intf_net [get_bd_intf_pins M02_AXIS] [get_bd_intf_pins ch1_mem_fb_split/M02_AXIS]
connect_bd_intf_net [get_bd_intf_pins M00_AXIS] [get_bd_intf_pins ch1_mem_fb_split/M00_AXIS]
connect_bd_intf_net -intf_net Vaux9_1 [get_bd_intf_pins Vaux9] [get_bd_intf_pins xadc_wiz_0/Vaux9]
connect_bd_intf_net [get_bd_intf_pins Vp_Vn] [get_bd_intf_pins xadc_wiz_0/Vp_Vn]
connect_bd_intf_net -intf_net Vaux0_1 [get_bd_intf_pins Vaux0] [get_bd_intf_pins xadc_wiz_0/Vaux0]
connect_bd_intf_net [get_bd_intf_pins ch1_mem_fb_split/S_AXIS] [get_bd_intf_pins xadc_read_0/m_axis]
connect_bd_intf_net [get_bd_intf_pins M01_AXIS] [get_bd_intf_pins ch1_mem_fb_split/M01_AXIS]
connect_bd_intf_net -intf_net Vaux8_1 [get_bd_intf_pins Vaux8] [get_bd_intf_pins xadc_wiz_0/Vaux8]
connect_bd_net -net pll_0_clk_out1 [get_bd_pins aclk] \
  [get_bd_pins axis_red_pitaya_adc_0/aclk] [get_bd_pins xadc_wiz_0/s_axis_aclk] [get_bd_pins xadc_read_0/aclk] \
  [get_bd_pins xadc_wiz_0/m_axis_aclk] [get_bd_pins ch1_mem_fb_split/aclk]
connect_bd_net -net rst_0_peripheral_aresetn [get_bd_pins aresetn] \
  [get_bd_pins xadc_read_0/aresetn] [get_bd_pins xadc_wiz_0/m_axis_resetn] [get_bd_pins ch1_mem_fb_split/aresetn]
connect_bd_net [get_bd_pins axis_red_pitaya_adc_0/adc_csn] [get_bd_pins adc_csn_o]
connect_bd_net [get_bd_pins adc_dat_a_i] [get_bd_pins axis_red_pitaya_adc_0/adc_dat_a]
connect_bd_net [get_bd_pins adc_dat_b_i] [get_bd_pins axis_red_pitaya_adc_0/adc_dat_b]

current_bd_instance /
connect_bd_intf_net [get_bd_intf_ports Vp_Vn] [get_bd_intf_pins Analog_Input/Vp_Vn]
connect_bd_intf_net [get_bd_intf_pins Analog_Input/M01_AXIS] [get_bd_intf_pins data_aquisition/S_AXIS_CANNEL_4]
connect_bd_intf_net -intf_net ps_0_DDR [get_bd_intf_ports DDR] [get_bd_intf_pins Prozessing_System/DDR]
connect_bd_intf_net [get_bd_intf_pins Analog_Input/M02_AXIS] [get_bd_intf_pins data_aquisition/S_AXIS_CANNEL_5]
connect_bd_intf_net -intf_net Vaux8_1 [get_bd_intf_ports Vaux8] [get_bd_intf_pins Analog_Input/Vaux8]
connect_bd_intf_net [get_bd_intf_pins Prozessing_System/M_AXIS] [get_bd_intf_pins data_aquisition/S_AXIS]
connect_bd_intf_net -intf_net Vaux9_1 [get_bd_intf_ports Vaux9] [get_bd_intf_pins Analog_Input/Vaux9]
connect_bd_intf_net -intf_net conv_0_M_AXIS [get_bd_intf_pins Prozessing_System/S_AXIS] [get_bd_intf_pins data_aquisition/M_AXIS]
connect_bd_intf_net -intf_net ps_0_FIXED_IO [get_bd_intf_ports FIXED_IO] [get_bd_intf_pins Prozessing_System/FIXED_IO]
connect_bd_intf_net -intf_net Vaux0_1 [get_bd_intf_ports Vaux0] [get_bd_intf_pins Analog_Input/Vaux0]
connect_bd_intf_net [get_bd_intf_pins Analog_Input/M03_AXIS] [get_bd_intf_pins data_aquisition/S_AXIS_CANNEL_6]
connect_bd_intf_net -intf_net S_AXIS_CANNEL_8_1 [get_bd_intf_pins data_aquisition/S_AXIS_CANNEL_8] [get_bd_intf_pins Prozessing_System/M_AXIS_dds_out]
connect_bd_intf_net [get_bd_intf_pins Analog_Input/M_AXIS] [get_bd_intf_pins data_aquisition/S_AXIS1]
connect_bd_intf_net -intf_net Vaux1_1 [get_bd_intf_ports Vaux1] [get_bd_intf_pins Analog_Input/Vaux1]
connect_bd_intf_net [get_bd_intf_pins Analog_Input/M00_AXIS] [get_bd_intf_pins data_aquisition/S_AXIS_CANNEL_3]
connect_bd_intf_net [get_bd_intf_pins Prozessing_System/M_AXIS2] [get_bd_intf_pins dds_compiler_0/S_AXIS_PHASE]
connect_bd_intf_net [get_bd_intf_pins ch1_output_dac_mem_split_1/M00_AXIS] [get_bd_intf_pins axis_combiner_1/S00_AXIS]
connect_bd_intf_net [get_bd_intf_pins axis_combiner_1/M_AXIS] [get_bd_intf_pins axis_red_pitaya_dac_0/S_AXIS]
connect_bd_intf_net [get_bd_intf_pins ch1_output_dac_mem_split_1/S_AXIS] [get_bd_intf_pins dds_compiler_0/M_AXIS_DATA]
connect_bd_intf_net [get_bd_intf_pins ch1_output_dac_mem_split_2/M00_AXIS] [get_bd_intf_pins axis_combiner_1/S01_AXIS]
connect_bd_intf_net [get_bd_intf_pins dds_compiler_1/M_AXIS_DATA] [get_bd_intf_pins ch1_output_dac_mem_split_2/S_AXIS]
connect_bd_net [get_bd_ports adc_clk_p_i] [get_bd_pins Prozessing_System/adc_clk_p_i]
connect_bd_net [get_bd_ports adc_clk_n_i] [get_bd_pins Prozessing_System/adc_clk_n_i]
connect_bd_net -net rst_0_peripheral_aresetn [get_bd_pins Prozessing_System/aresetn] \
  [get_bd_pins data_aquisition/aresetn1] [get_bd_pins Calculation/aresetn] [get_bd_pins Analog_Input/aresetn] \
  [get_bd_pins axis_combiner_1/aresetn] [get_bd_pins dds_compiler_0/aresetn] [get_bd_pins dds_compiler_1/aresetn] \
  [get_bd_pins ch1_output_dac_mem_split_1/aresetn] [get_bd_pins ch1_output_dac_mem_split_2/aresetn]
connect_bd_net -net pll_0_clk_out1 [get_bd_pins Prozessing_System/aclk] \
  [get_bd_pins data_aquisition/aclk] [get_bd_pins Calculation/aclk] [get_bd_pins axis_red_pitaya_dac_0/aclk] \
  [get_bd_pins Analog_Input/aclk] [get_bd_pins axis_combiner_1/aclk] [get_bd_pins dds_compiler_0/aclk] \
  [get_bd_pins dds_compiler_1/aclk] [get_bd_pins ch1_output_dac_mem_split_1/aclk] \
  [get_bd_pins ch1_output_dac_mem_split_2/aclk]
connect_bd_net -net feedback_combined_0_trig_out [get_bd_pins Calculation/exp_p_tri_io] [get_bd_ports led_o] [get_bd_ports exp_p_tri_io]
connect_bd_net [get_bd_ports adc_dat_a_i] [get_bd_pins Analog_Input/adc_dat_a_i]
connect_bd_net [get_bd_ports adc_dat_b_i] [get_bd_pins Analog_Input/adc_dat_b_i]
connect_bd_net -net axis_red_pitaya_adc_0_adc_csn [get_bd_pins Analog_Input/adc_csn_o] [get_bd_ports adc_csn_o]
connect_bd_net [get_bd_pins axis_red_pitaya_dac_0/dac_clk] [get_bd_ports dac_clk_o]
connect_bd_net [get_bd_pins axis_red_pitaya_dac_0/dac_rst] [get_bd_ports dac_rst_o]
connect_bd_net [get_bd_pins axis_red_pitaya_dac_0/dac_dat] [get_bd_ports dac_dat_o]
connect_bd_net [get_bd_pins axis_red_pitaya_dac_0/dac_sel] [get_bd_ports dac_sel_o]
connect_bd_net [get_bd_pins axis_red_pitaya_dac_0/dac_wrt] [get_bd_ports dac_wrt_o]
connect_bd_net [get_bd_pins Prozessing_System/locked] [get_bd_pins axis_red_pitaya_dac_0/locked]
connect_bd_net [get_bd_pins Prozessing_System/clk_out2] [get_bd_pins axis_red_pitaya_dac_0/wrt_clk] [get_bd_pins axis_red_pitaya_dac_0/ddr_clk]
connect_bd_net [get_bd_pins xlslice_0/Dout] [get_bd_pins dds_compiler_1/s_axis_phase_tdata]
connect_bd_net [get_bd_pins dds_compiler_0/m_axis_phase_tdata] [get_bd_pins xlslice_0/Din]
connect_bd_net [get_bd_pins dds_compiler_0/m_axis_phase_tvalid] [get_bd_pins dds_compiler_1/s_axis_phase_tvalid]

# ---- address map ----
assign_bd_address -offset 0x40000000 -range 4K -target_address_space [get_bd_addr_spaces Prozessing_System/Core/ps_0/Data] [get_bd_addr_segs Prozessing_System/Memory_IO/axi_sts_register_0/s_axi/reg0]
assign_bd_address -offset 0x40001000 -range 4K -target_address_space [get_bd_addr_spaces Prozessing_System/Core/ps_0/Data] [get_bd_addr_segs Prozessing_System/Memory_IO/axi_cfg_register_0/s_axi/reg0]
assign_bd_address -offset 0x00000000 -range 512M -target_address_space [get_bd_addr_spaces Prozessing_System/Memory_IO/axis_ram_writer_0/M_AXI] [get_bd_addr_segs Prozessing_System/Core/ps_0/S_AXI_ACP/ACP_DDR_LOWOCM]

validate_bd_design
save_bd_design
